# EAGLE schematic deflectorshield (EAGLE 7.7.0)
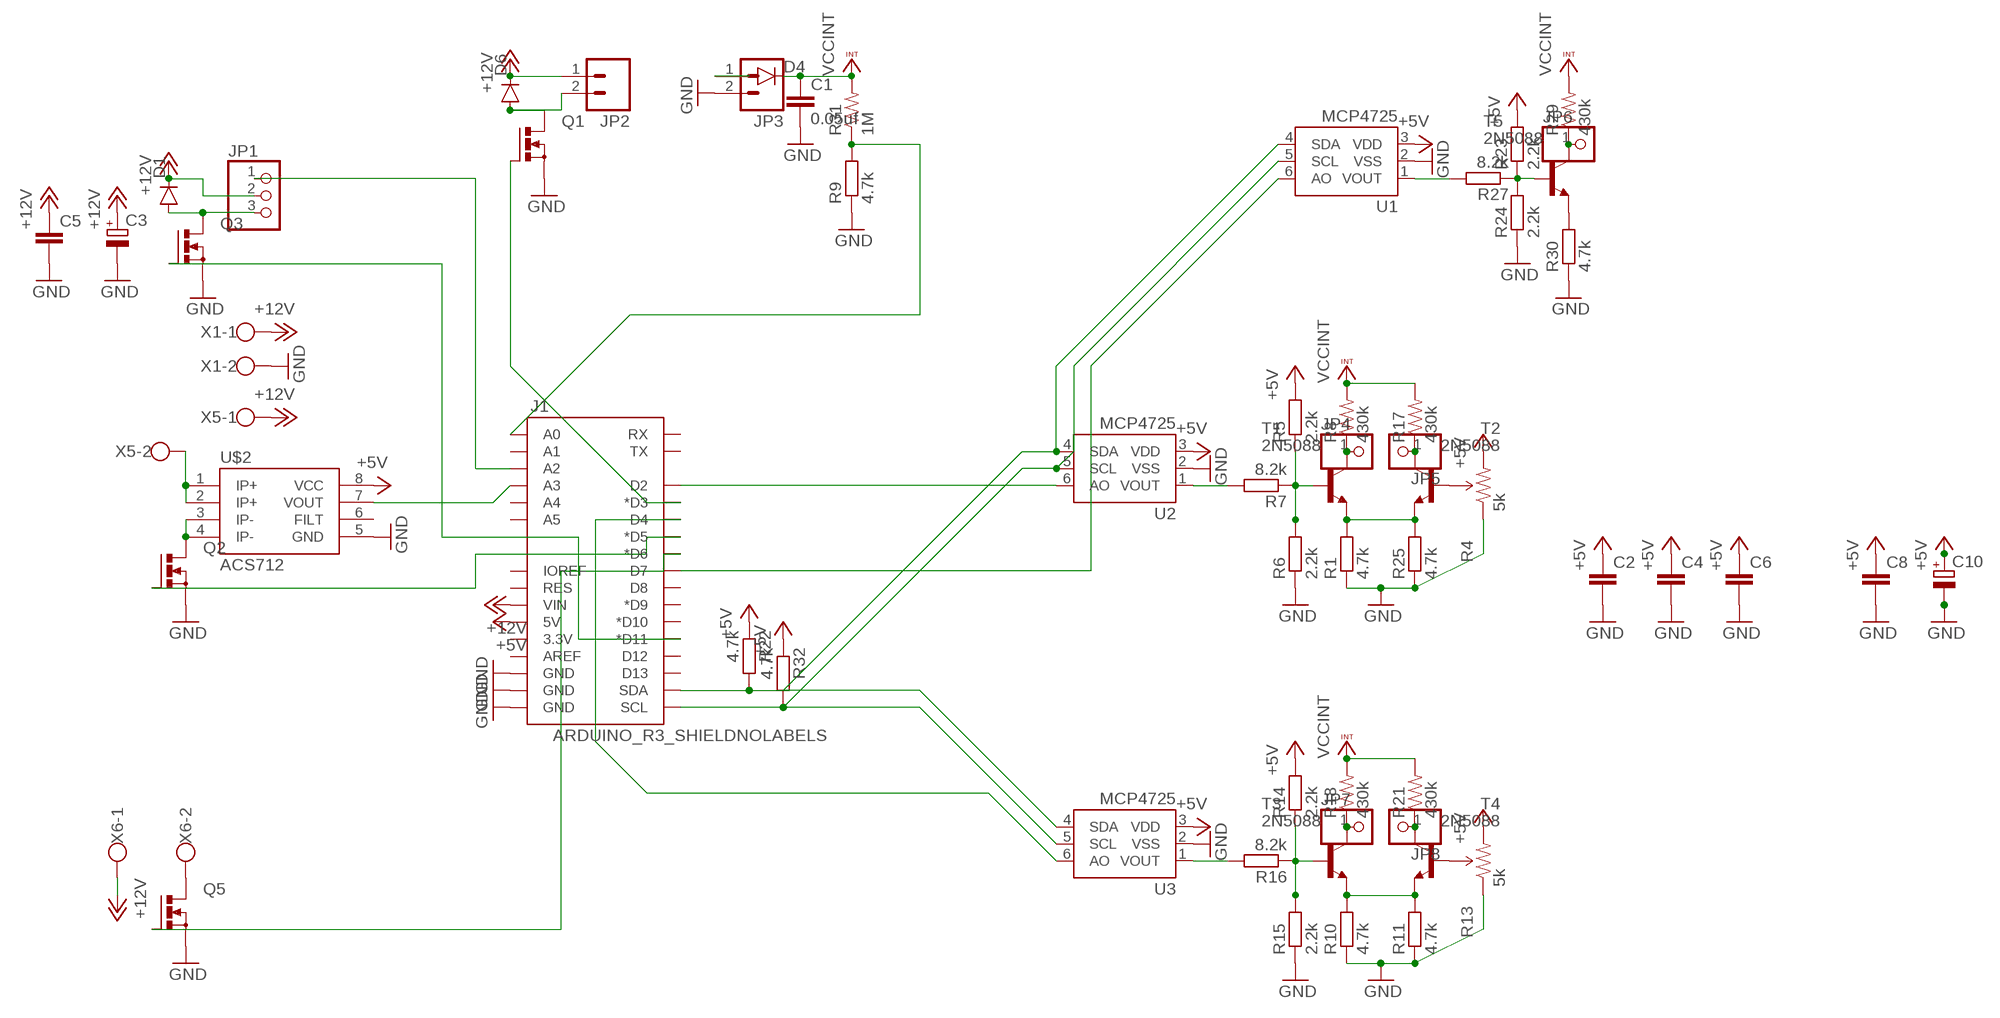
[diagram p0: schematic, sheet 1]

## Parts
C1  0.05uf  CC1206  [C1206]
C2  C-EUC0603  [C0603]
C3  CPOL-EUE5-13  [E5-13]
C4  C-EUC0603  [C0603]
C5  C-EUC0805  [C0805]
C6  C-EUC0603  [C0603]
C8  C-EUC0603  [C0603]
C10  CPOL-EUE5-6  [E5-6]
D1  DIODESOD123  [SOD-123]
D4  DIODESOD123  [SOD-123]
D6  DIODESOD123  [SOD-123]
J1  ARDUINO_R3_SHIELDNOLABELS  [UNO_R3_SHIELD_NOLABELS]
JP1  PINHD-1X3  [1X03]
JP2  M02PTH  [1X02]
JP3  M02PTH  [1X02]
JP4  PINHD-1X1  [1X01]
JP5  PINHD-1X1  [1X01]
JP6  PINHD-1X1  [1X01]
JP7  PINHD-1X1  [1X01]
JP8  PINHD-1X1  [1X01]
Q1  N-MOSFET-SO8S  [SO-08]
Q2  N-MOSFET-SO8S  [SO-08]
Q3  N-MOSFET-SO8S  [SO-08]
Q5  N-MOSFET-SO8S  [SO-08]
R1  4.7k  R-EU_R0603  [R0603]
R4  5k  TRIMPOTTRIMPOT_PTH_S3_LOCK  [TRIMPOT_PTH_S3_LOCK]
R5  2.2k  R-EU_R0603  [R0603]
R6  2.2k  R-EU_R0603  [R0603]
R7  8.2k  R-EU_R0603  [R0603]
R8  430k  RESISTOR1206  [1206]
R9  4.7k  R-EU_R0603  [R0603]
R10  4.7k  R-EU_R0603  [R0603]
R11  4.7k  R-EU_R0603  [R0603]
R13  5k  TRIMPOTTRIMPOT_PTH_S3_LOCK  [TRIMPOT_PTH_S3_LOCK]
R14  2.2k  R-EU_R0603  [R0603]
R15  2.2k  R-EU_R0603  [R0603]
R16  8.2k  R-EU_R0603  [R0603]
R17  430k  RESISTOR1206  [1206]
R18  430k  RESISTOR1206  [1206]
R21  430k  RESISTOR1206  [1206]
R22  4.7k  R-EU_R0603  [R0603]
R23  2.2k  R-EU_R0603  [R0603]
R24  2.2k  R-EU_R0603  [R0603]
R25  4.7k  R-EU_R0603  [R0603]
R27  8.2k  R-EU_R0603  [R0603]
R29  430k  RESISTOR1206  [1206]
R30  4.7k  R-EU_R0603  [R0603]
R31  1M  RESISTOR1206  [1206]
R32  4.7k  R-EU_R0603  [R0603]
T1  2N5088  [TO92]
T2  2N5088  [TO92]
T3  2N5088  [TO92]
T4  2N5088  [TO92]
T5  2N5088  [TO92]
U1  MCP4725  MCP4725SOT-23  [SOT23-6]
U2  MCP4725  MCP4725SOT-23  [SOT23-6]
U3  MCP4725  MCP4725SOT-23  [SOT23-6]
U$2  ACS712  [SO08]
X1  W237-102  [W237-102]
X5  W237-102  [W237-102]
X6  W237-102  [W237-102]

## Nets
+5V: C2.1 C4.1 C6.1 C8.1 C10.+ J1.5V R4.3(CW) R5.2 R13.3(CW) R14.2 R22.1 R23.2 R32.1 U1.3(VDD) U2.3(VDD) U3.3(VDD) U$2.8(VCC)
+12V: C3.+ C5.1 D1.C D6.C J1.VIN JP1.2 JP2.1 X1.1 X5.1 X6.1
GND: C1.2 C2.2 C3.- C4.2 C5.2 C6.2 C8.2 C10.- J1.GND@0(GND) J1.GND@1(GND) J1.GND@2(GND) JP3.2 Q1.1(S) Q1.2(S) Q1.3(S) Q2.1(S) Q2.2(S) Q2.3(S) Q3.1(S) Q3.2(S) Q3.3(S) Q5.1(S) Q5.2(S) Q5.3(S) R1.1 R4.1(CCW) R6.1 R9.1 R10.1 R11.1 R13.1(CCW) R15.1 R24.1 R25.1 R30.1 U1.2(VSS) U2.2(VSS) U3.2(VSS) U$2.5(GND) X1.2
N$1 [med]: JP4.1 R8.1 T1.1(C)
N$2 [med]: JP5.1 R17.1 T2.1(C)
N$3: R7.2 U2.1(VOUT)
N$4: R1.2 R25.2 T1.3(E) T2.3(E)
N$5: R4.2(WIPER) T2.2(B)
N$6: R13.2(WIPER) T4.2(B)
N$7: R30.2 T5.3(E)
N$8: R5.1 R6.2 R7.1 T1.2(B)
N$10: J1.D3(*D3) Q1.4(G)
N$11: R10.2 R11.2 T3.3(E) T4.3(E)
N$13: J1.SDA R22.2 U1.4(SDA) U2.4(SDA) U3.4(SDA)
N$14: R14.1 R15.2 R16.1 T3.2(B)
N$15 [med]: JP8.1 R21.1 T4.1(C)
N$16 [med]: JP7.1 R18.1 T3.1(C)
N$17: R16.2 U3.1(VOUT)
N$18: J1.D2 U2.6(AO)
N$19: J1.D4 U3.6(AO)
N$20: J1.A0 R9.2 R31.1
N$21: D6.A JP2.2 Q1.5(D) Q1.6(D) Q1.7(D) Q1.8(D)
N$23: Q2.5(D) Q2.6(D) Q2.7(D) Q2.8(D) U$2.3(IP-) U$2.4(IP-)
N$24: U$2.1(IP+) U$2.2(IP+) X5.2
N$25: J1.D5(*D5) Q2.4(G)
N$26: D1.A JP1.3 Q3.5(D) Q3.6(D) Q3.7(D) Q3.8(D)
N$32: D4.A JP3.1
N$33: R23.1 R24.2 R27.1 T5.2(B)
N$34: R27.2 U1.1(VOUT)
N$35: J1.SCL R32.2 U1.5(SCL) U2.5(SCL) U3.5(SCL)
N$36: JP6.1 R29.1 T5.1(C)
N$38: J1.D11(*D11) Q3.4(G)
N$40: J1.A2 JP1.1
N$41 [med]: Q5.5(D) Q5.6(D) Q5.7(D) Q5.8(D) X6.2
N$42: J1.D6(*D6) Q5.4(G)
N$43: J1.A3 U$2.7(VOUT)
N$45: J1.D7 U1.6(AO)
VCCINT [med]: C1.1 D4.C R8.2 R17.2 R18.2 R21.2 R29.2 R31.2
Unconnected: J1.3.3V J1.A1 J1.A4 J1.A5 J1.AREF J1.D8 J1.D9(*D9) J1.D10(*D10) J1.D12 J1.D13 J1.IOREF J1.RES J1.RX J1.TX U$2.6(FILT)

## Library data of the parts
C1 = eagle-ltspice:C: CAPACITOR, European symbol; SPICEMODEL: NONE; SPICEPREFIX: C
C2 C4 C6 C8 = rcl:C-EU: CAPACITOR, European symbol
C3 C10 = rcl:CPOL-EU: POLARIZED CAPACITOR, European symbol
C5 = resistor:C-EU: CAPACITOR, European symbol
D1 D4 D6 = SparkFun-DiscreteSemi:DIODE: Diode These are standard reverse protection diodes and small signal diodes. SMA package can handle up to about 1A. SOD-323 can handle about 200mA. What the SOD-323 package when ordering, there are some mfgs out there that are 5-pin packages.
J1 = SparkFun-Boards:ARDUINO_R3_SHIELD: Shield form compatible with the Arduino Uno R3.
JP1 = pinhead:PINHD-1X3: PIN HEADER
JP2 JP3 = SparkFun-Connectors:M02: Standard 2-pin 0.1" header. Use with - straight break away headers ( PRT-00116) - right angle break away headers (PRT-00553) - swiss pins (PRT-00743) - machine pins (PRT-00117) - female headers (PRT-00115) Molex polarized connector foot print use with: PRT-08233 with associated crimp pins and housings. 2.54_SCREWTERM for use with PRT-10571. 3.5mm Screw Terminal footprints for PRT-08084 5mm Screw Terminal footprints for use with PRT-08432
JP4-JP8 = pinhead:PINHD-1X1: PIN HEADER
Q1-Q3 Q5 = transistor-power:N-MOSFET-SO8: N-Channel MOSFET Example: FDS7760A; N-Channel Logic Level PowerTrench® MOSFET FDS2572; N-Channel UltraFET® Trench MOSFET Source: www.fairchildsemi.com
R1 R5-R7 R9-R11 R14-R16 R22-R25 R27 R30 R32 = rcl:R-EU_: RESISTOR, European symbol
R4 R13 = SparkFun-Electromechanical:TRIMPOT: Various small potentiometers for "set-and-forget" applications
R8 R17 R18 R21 R29 R31 = SparkFun-Resistors:RESISTOR: Resistor Basic schematic elements and footprints for 0603, 1206, and PTH resistors.
T1-T5 = transistor:2N5088: NPN TRANSISTOR
U1-U3 = SparkFun-AnalogIC:MCP4725: Microchip 12-bit I2C DAC, SOT23-6; PROD_ID: IC-08886
U$2 = SparkFun-AnalogIC:ACS712: Hall-effect-based isolated linear current sensor; PROD_ID: IC-08964
X1 X5 X6 = con-wago-500:W237-102: WAGO SCREW CLAMP; MPN: 237-102; OC_FARNELL: unknown; OC_NEWARK: 70K9898

## Net classes
1 med: width 0.254 mm, clearance 1.27 mm
2 hv: width 0.254 mm, clearance 3.81 mm